# EAGLE schematic MOD-Z_01_V01 (EAGLE 9.6.2)
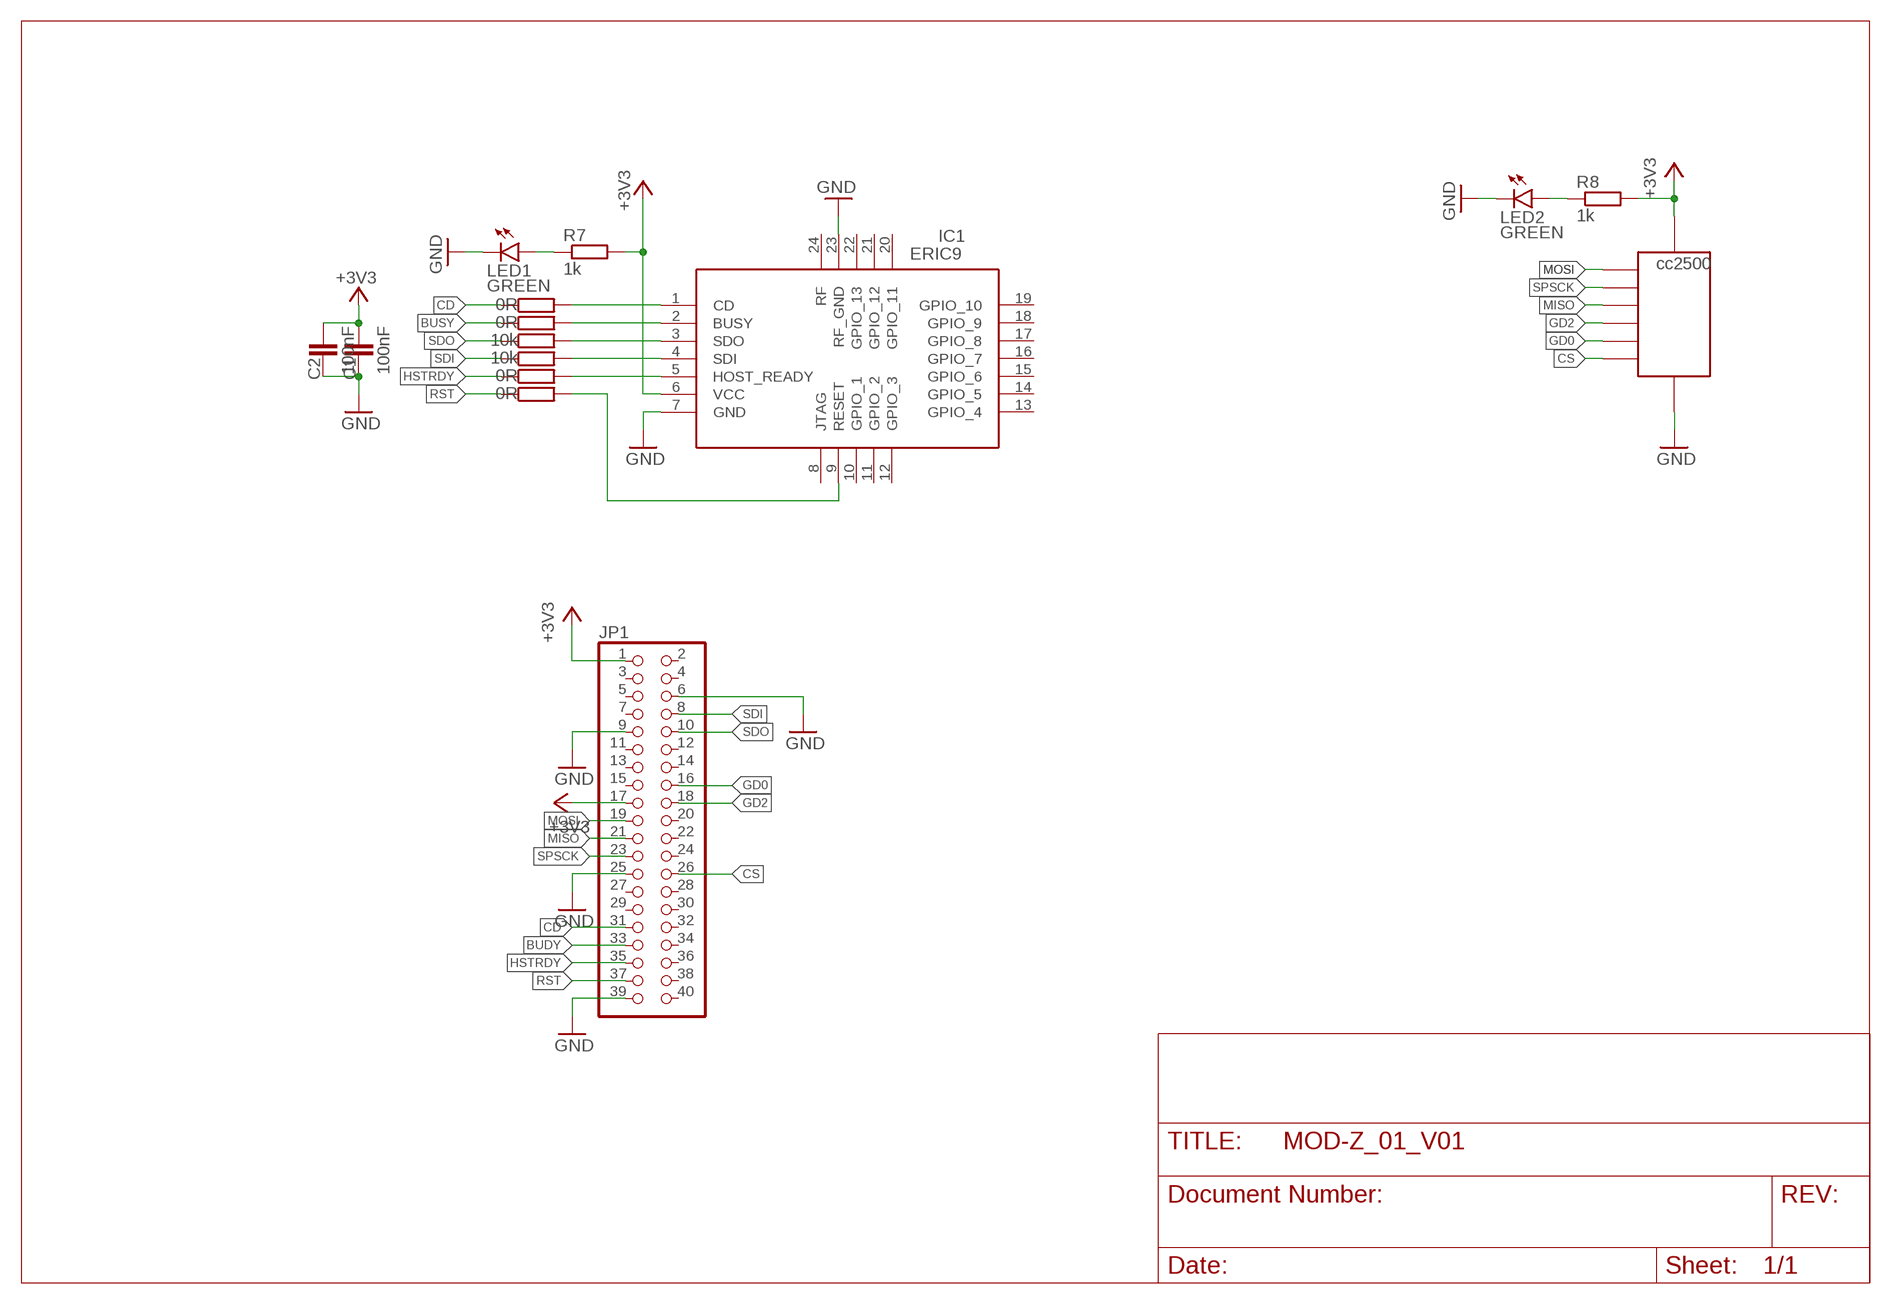
[diagram p0: schematic, sheet 1]

## Parts
C1  100nF  C-EUC0805  [C0805]
C2  100nF  C-EUC0805  [C0805]
IC1  ERIC9  [ERIC9]
IC2  CC2500  [CC2500]
JP1  PINHD-2X20  [2X20]
LED1  GREEN  LEDCHIP-LED0805  [CHIP-LED0805]
LED2  GREEN  LEDCHIP-LED0805  [CHIP-LED0805]
R1  0R  R-EU_R0805  [R0805]
R2  0R  R-EU_R0805  [R0805]
R3  10k  R-EU_R0805  [R0805]
R4  10k  R-EU_R0805  [R0805]
R5  0R  R-EU_R0805  [R0805]
R6  0R  R-EU_R0805  [R0805]
R7  1k  R-EU_R0805  [R0805]
R8  1k  R-EU_R0805  [R0805]

## Nets
+3V3: C1.1 C2.1 IC1.6(VCC) IC2.+3V3 JP1.1 JP1.17 R7.2 R8.2
BUDY: JP1.33
BUSY: R2.1
CD: JP1.31 R1.1
CS: IC2.CS JP1.26
GD0: IC2.SPSCK JP1.16
GD2: IC2.MOSI JP1.18
GND: C1.2 C2.2 IC1.7(GND) IC1.23(RF_GND) IC2.GND JP1.6 JP1.9 JP1.25 JP1.39 LED1.C LED2.C
HSTRDY: JP1.35 R5.1
MISO: IC2.MISO JP1.21
MOSI: IC2.GD0 JP1.19
N$1: LED2.A R8.1
N$2: IC1.1(CD) R1.2
N$4: IC1.9(RESET) R6.2
N$5: IC1.2(BUSY) R2.2
N$6: IC1.3(SDO) R3.2
N$7: IC1.4(SDI) R4.2
N$8: IC1.5(HOST_READY) R5.2
N$19: LED1.A R7.1
RST: JP1.37 R6.1
SDI: JP1.8 R4.1
SDO: JP1.10 R3.1
SPSCK: IC2.GD2 JP1.23
Unconnected: IC1.8(JTAG) IC1.10(GPIO_1) IC1.11(GPIO_2) IC1.12(GPIO_3) IC1.13(GPIO_4) IC1.14(GPIO_5) IC1.15(GPIO_6) IC1.16(GPIO_7) IC1.17(GPIO_8) IC1.18(GPIO_9) IC1.19(GPIO_10) IC1.20(GPIO_11) IC1.21(GPIO_12) IC1.22(GPIO_13) IC1.24(RF) JP1.2 JP1.3 JP1.4 JP1.5 JP1.7 JP1.11 JP1.12 JP1.13 JP1.14 JP1.15 JP1.20 JP1.22 JP1.24 JP1.27 JP1.28 JP1.29 JP1.30 JP1.32 JP1.34 JP1.36 JP1.38 JP1.40

## Library data of the parts
C1 C2 = rcl:C-EU: CAPACITOR, European symbol; SPICEPREFIX: C
IC1 = eRIC9:ERIC9: eRIC9 Radio Transceiver !! Source: Datasheet <https://www.mouser.com/datasheet/2/743/lprs_eRIC9-FCC-1217491.pdf>; DESCRIPTION: eRIC9 Radio Transceiver !!; HEIGHT: 2mm; MANUFACTURER_NAME: LPRS; MANUFACTURER_PART_NUMBER: eRIC9
IC2 = Andreas:CC2500
JP1 = pinhead:PINHD-2X20: PIN HEADER
LED1 LED2 = led:LED: LED OSRAM: - CHIPLED LG R971, LG N971, LY N971, LG Q971, LY Q971, LO R971, LY R971 LH N974, LH R974 LS Q976, LO Q976, LY Q976 LO Q996 - Hyper CHIPLED LW Q18S LB Q993, LB Q99A, LB R99A - SideLED LS A670, LO A670, LY A670, LG A670, LP A670 LB A673, LV A673, LT A673, LW A673 LH A674 LY A675 LS A676, LA A676, LO A676, LY A676, LW A676 LS A679, LY A679, LG A679 - Hyper Micro SIDELED® LS Y876, LA Y876, LO Y876, LY Y876 LT Y87S - SmartLED LW L88C, LW L88S LB L89C, LB L89S, LG L890 LS L89K, LO L89K, LY L89K LS L896, LA L896, LO L896, LY L896 - TOPLED LS T670, LO T670, LY T670, LG T670, LP T670 LSG T670, LSP T670, LSY T670, LOP T670, LYG T670 LG T671, LOG T671, LSG T671 LB T673, LV T673, LT T673, LW T673 LH T674 LS T676, LA T676, LO T676, LY T676, LB T676, LH T676, LSB T676, LW T676 LB T67C, LV T67C, LT T67C, LS T67K, LO T67K, LY T67K, LW E67C LS E67B, LA E67B, LO E67B, LY E67B, LB E67C, LV E67C, LT E67C LW T67C LS T679, LY T679, LG T679 LS T770, LO T770, LY T770, LG T770, LP T770 LB T773, LV T773, LT T773, LW T773 LH T774 LS E675, LA E675, LY E675, LS T675 LS T776, LA T776, LO T776, LY T776, LB T776 LHGB T686 LT T68C, LB T68C - Hyper Mini TOPLED® LB M676 - Mini TOPLED Santana® LG M470 LS M47K, LO M47K, LY M47K Source: http://www.osram.convergy.de LUXEON: - LUMILED® LXK2-PW12-R00, LXK2-PW12-S00, LXK2-PW14-U00, LXK2-PW14-V00 LXK2-PM12-R00, LXK2-PM12-S00, LXK2-PM14-U00 LXK2-PE12-Q00, LXK2-PE12-R00, LXK2-PE12-S00, LXK2-PE14-T00, LXK2-PE14-U00 LXK2-PB12-K00, LXK2-PB12-L00, LXK2-PB12-M00, LXK2-PB14-N00, LXK2-PB14-P00, LXK2-PB14-Q00 LXK2-PR12-L00, LXK2-PR12-M00, LXK2-PR14-Q00, LXK2-PR14-R00 LXK2-PD12-Q00, LXK2-PD12-R00, LXK2-PD12-S00 LXK2-PH12-R00, LXK2-PH12-S00 LXK2-PL12-P00, LXK2-PL12-Q00, LXK2-PL12-R00 Source: www.luxeon.com KINGBRIGHT: KA-3528ASYC Source: www.kingbright.com
R1-R8 = rcl:R-EU_: RESISTOR, European symbol; SPICEPREFIX: R